# EAGLE design v2 (EAGLE 9.5.2)
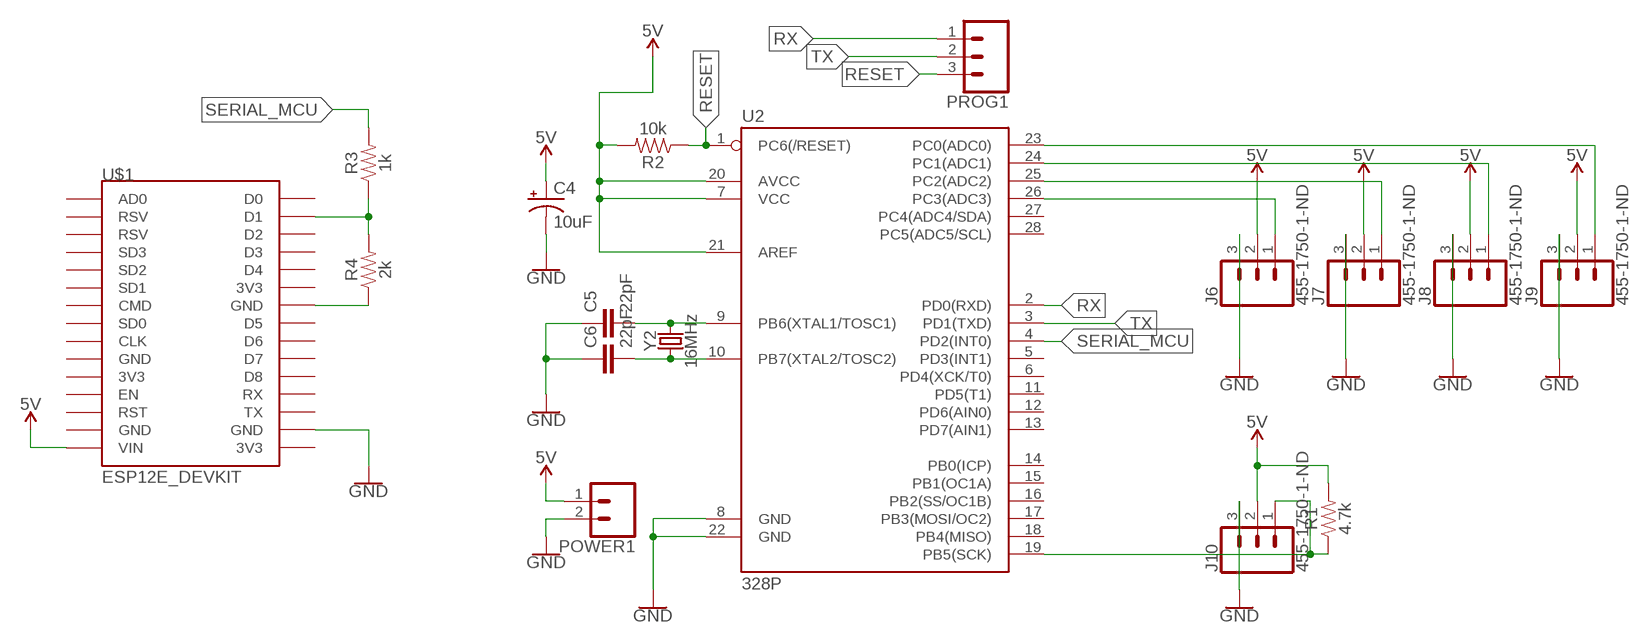
[diagram p0: schematic, sheet 1]

## Parts
C4  10uF  10UF-POLAR-RADIAL-2.5MM-25V-20%  [CPOL-RADIAL-2.5MM-5MM]
C5  22pF  22PF-PTH-2.54MM-200V-5%  [CAP-PTH-2.54]
C6  22pF  22PF-PTH-2.54MM-200V-5%  [CAP-PTH-2.54]
J6  455-1750-1-ND  CONN_03  [1X03]
J7  455-1750-1-ND  CONN_03  [1X03]
J8  455-1750-1-ND  CONN_03  [1X03]
J9  455-1750-1-ND  CONN_03  [1X03]
J10  455-1750-1-ND  CONN_03  [1X03]
POWER1  CONN_02  [1X02]
PROG1  CONN_03  [1X03]
R1  4.7k  10KOHM-HORIZ-1/4W-1%  [AXIAL-0.3]
R2  10k  1KOHM-HORIZ-1/4W-1%  [AXIAL-0.3]
R3  1k  10KOHM-HORIZ-1/4W-1%  [AXIAL-0.3]
R4  2k  10KOHM-HORIZ-1/4W-1%  [AXIAL-0.3]
U2  328P  ATMEGA328P_PDIP  [DIP28]
U$1  ESP12E_DEVKIT  [ESP12E_DEVKIT]
Y2  16MHz  CRYSTAL-16MHZPTH-HC49US  [HC49US]

## Nets
5V: C4.1(+) J6.2 J7.2 J8.2 J9.2 J10.2 POWER1.1 R1.P$2 R2.P$2 U2.7(VCC) U2.20(AVCC) U2.21(AREF) U$1.VIN
GND: C4.2(-) C5.1 C6.1 J6.3 J7.3 J8.3 J9.3 J10.3 POWER1.2 U2.8(GND) U2.22(GND) U$1.GND@3(GND)
N$1: C5.2 U2.9(PB6(XTAL1/TOSC1)) Y2.2
N$2: C6.2 U2.10(PB7(XTAL2/TOSC2)) Y2.1
N$3: J6.1 U2.26(PC3(ADC3))
N$4: J7.1 U2.25(PC2(ADC2))
N$5: J8.1 U2.24(PC1(ADC1))
N$6: J9.1 U2.23(PC0(ADC0))
N$7: R3.P$1 R4.P$2 U$1.D1
N$8: J10.1 R1.P$1 U2.19(PB5(SCK))
N$11: R4.P$1 U$1.GND@2(GND)
RESET: PROG1.3 R2.P$1 U2.1(PC6(/RESET))
RX: PROG1.1 U2.2(PD0(RXD))
SERIAL_MCU: R3.P$2 U2.4(PD2(INT0))
TX: PROG1.2 U2.3(PD1(TXD))
Unconnected: U2.5(PD3(INT1)) U2.6(PD4(XCK/T0)) U2.11(PD5(T1)) U2.12(PD6(AIN0)) U2.13(PD7(AIN1)) U2.14(PB0(ICP)) U2.15(PB1(OC1A)) U2.16(PB2(SS/OC1B)) U2.17(PB3(MOSI/OC2)) U2.18(PB4(MISO)) U2.27(PC4(ADC4/SDA)) U2.28(PC5(ADC5/SCL)) U$1.3V3@0(3V3) U$1.3V3@1(3V3) U$1.3V3@2(3V3) U$1.AD0 U$1.CLK U$1.CMD U$1.D0 U$1.D2 U$1.D3 U$1.D4 U$1.D5 U$1.D6 U$1.D7 U$1.D8 U$1.EN U$1.GND@0(GND) U$1.GND@1(GND) U$1.RST U$1.RSV@0(RSV) U$1.RSV@1(RSV) U$1.RX U$1.SD0 U$1.SD1 U$1.SD2 U$1.SD3 U$1.TX

## Library data of the parts
C4 = SparkFun-Capacitors:10UF-POLAR: 10.0µF polarized capacitors A capacitor is a passive two-terminal electrical component used to store electrical energy temporarily in an electric field.; PROD_ID: CAP-08440
C5 C6 = SparkFun-Capacitors:22PF: 22pF ceramic capacitors A capacitor is a passive two-terminal electrical component used to store electrical energy temporarily in an electric field.; PROD_ID: CAP-09128
J6-J10 = SparkFun-Connectors:CONN_03: Multi connection point. Often used as Generic Header-pin footprint for 0.1 inch spaced/style header connections On any of the 0.1 inch spaced packages, you can populate with these: Break Away Headers - Straight <https://www.sparkfun.com/products/116> (PRT-00116) Break Away Male Headers - Right Angle <https://www.sparkfun.com/products/553> (PRT-00553) Female Headers <https://www.sparkfun.com/products/115> (PRT-00115) Break Away Headers - Machine Pin <https://www.sparkfun.com/products/117> (PRT-00117) Break Away Female Headers - Swiss Machine Pin <https://www.sparkfun.com/products/743> (PRT-00743) Stackable Header - 3 Pin (Female, 0.1") <https://www.sparkfun.com/products/13875> (PRT-13875) For SCREWTERMINALS and SPRING TERMINALS visit here: Screw Terimnals on SparkFun.com <https://www.sparkfun.com/search/results?term=Screw+Terminals> (5mm/3.5mm/2.54mm spacing) This device is also useful as a general connection point to wire up your design to another part of your project. Our various solder wires solder well into these plated through hole pads. Hook-Up Wire - Assortment (Stranded, 22 AWG) <https://www.sparkfun.com/products/11375> (PRT-11375) Hook-Up Wire - Assortment (Solid Core, 22 AWG) <https://www.sparkfun.com/products/11367> (PRT-11367) View the entire wire category on our website here <https://www.sparkfun.com/categories/141> Special notes: Molex polarized connector foot print use with SKU : PRT-08232 with associated crimp pins and housings.; PROD_ID: XXX-00000
POWER1 = SparkFun-Connectors:CONN_02: Multi connection point. Often used as Generic Header-pin footprint for 0.1 inch spaced/style header connections On any of the 0.1 inch spaced packages, you can populate with these: Break Away Headers - Straight <https://www.sparkfun.com/products/116> (PRT-00116) Break Away Male Headers - Right Angle <https://www.sparkfun.com/products/553> (PRT-00553) Female Headers <https://www.sparkfun.com/products/115> (PRT-00115) Break Away Headers - Machine Pin <https://www.sparkfun.com/products/117> (PRT-00117) Break Away Female Headers - Swiss Machine Pin <https://www.sparkfun.com/products/743> (PRT-00743) For SCREWTERMINALS and SPRING TERMINALS visit here: Screw Terimnals on SparkFun.com <https://www.sparkfun.com/search/results?term=Screw+Terminals> (5mm/3.5mm/2.54mm spacing) This device is also useful as a general connection point to wire up your design to another part of your project. Our various solder wires solder well into these plated through hole pads. Hook-Up Wire - Assortment (Stranded, 22 AWG) <https://www.sparkfun.com/products/11375> (PRT-11375) Hook-Up Wire - Assortment (Solid Core, 22 AWG) <https://www.sparkfun.com/products/11367> (PRT-11367) View the entire wire category on our website here <https://www.sparkfun.com/categories/141> Special notes: Molex polarized connector foot print use with: PRT-08233 with associated crimp pins and housings. 2.54_SCREWTERM for use with PRT-10571. 3.5mm Screw Terminal footprints for PRT-08084 5mm Screw Terminal footprints for use with PRT-08432
PROG1 = SparkFun-Connectors:CONN_03: Multi connection point. Often used as Generic Header-pin footprint for 0.1 inch spaced/style header connections On any of the 0.1 inch spaced packages, you can populate with these: Break Away Headers - Straight <https://www.sparkfun.com/products/116> (PRT-00116) Break Away Male Headers - Right Angle <https://www.sparkfun.com/products/553> (PRT-00553) Female Headers <https://www.sparkfun.com/products/115> (PRT-00115) Break Away Headers - Machine Pin <https://www.sparkfun.com/products/117> (PRT-00117) Break Away Female Headers - Swiss Machine Pin <https://www.sparkfun.com/products/743> (PRT-00743) Stackable Header - 3 Pin (Female, 0.1") <https://www.sparkfun.com/products/13875> (PRT-13875) For SCREWTERMINALS and SPRING TERMINALS visit here: Screw Terimnals on SparkFun.com <https://www.sparkfun.com/search/results?term=Screw+Terminals> (5mm/3.5mm/2.54mm spacing) This device is also useful as a general connection point to wire up your design to another part of your project. Our various solder wires solder well into these plated through hole pads. Hook-Up Wire - Assortment (Stranded, 22 AWG) <https://www.sparkfun.com/products/11375> (PRT-11375) Hook-Up Wire - Assortment (Solid Core, 22 AWG) <https://www.sparkfun.com/products/11367> (PRT-11367) View the entire wire category on our website here <https://www.sparkfun.com/categories/141> Special notes: Molex polarized connector foot print use with SKU : PRT-08232 with associated crimp pins and housings.
R1 R3 R4 = SparkFun-Resistors:10KOHM: 10kΩ resistor A resistor is a passive two-terminal electrical component that implements electrical resistance as a circuit element. Resistors act to reduce current flow, and, at the same time, act to lower voltage levels within circuits. - Wikipedia; PROD_ID: RES-12183; VALUE: 10k
R2 = SparkFun-Resistors:1KOHM: 1kΩ resistor A resistor is a passive two-terminal electrical component that implements electrical resistance as a circuit element. Resistors act to reduce current flow, and, at the same time, act to lower voltage levels within circuits. - Wikipedia; PROD_ID: RES-12182; VALUE: 1k
U2 = SparkFun-IC-Microcontroller:ATMEGA328P_PDIP: Atmel 328P Through hole ATMEGA328P uC used in the Arduino 32kb flash, 1k EEPROM, 2k SRAM Datasheet <http://www.sparkfun.com/datasheets/Components/SMD/ATMega328.pdf> SparkFun Products Storefront component: AVR 28 Pin 20MHz 32K 6A/D - ATMega328P <https://www.sparkfun.com/products/9061> (COM-09061) SparkFun Simon Says - Through-Hole Soldering Kit <https://www.sparkfun.com/products/10547> (KIT-10547) SparkFun Learn to Solder - Simon Says <https://www.sparkfun.com/products/13708> (KIT-13708) SparkFun BigTime Watch Kit <https://www.sparkfun.com/products/11734> (KIT-11734) SparkFun ClockIt <https://www.sparkfun.com/products/10930> (KIT-10930) SparkFun Serial Enabled LCD Kit <https://www.sparkfun.com/products/10097> (LCD-10097) SparkFun Simon Tilts - Through Hole Soldering Kit <https://www.sparkfun.com/products/12634> (KIT-12634) SparkFun Frequency Counter Kit <https://www.sparkfun.com/products/10140> (KIT-10140) FabFM Radio Kit <https://www.sparkfun.com/products/11043> (KIT-11043) SparkFun Binary Blaster Kit <https://www.sparkfun.com/products/12037> (KIT-12037) SparkFun Metro-Gnome <https://www.sparkfun.com/products/9236> (KIT-09236) ATmega328 with Arduino Optiboot (Uno) <https://www.sparkfun.com/products/10524> (DEV-10524); PROD_ID: IC-09136
U$1 = ESP12E_DEVKIT:ESP12E_DEVKIT: ESP12E DEVKIT BOARD
Y2 = SparkFun-Clocks:CRYSTAL-16MHZ: 16MHz Crystal Digikey Example <http://www.digikey.com/product-search/en?keywords=535-9122-1-ND> Frequency: 16MHz Frequency Stability: ±50ppm Frequency Tolerance: ±20ppm Load Capacitance: 18pF SparkFun Products: Pro Micro -5V/16MHz <https://www.sparkfun.com/products/12640> SparkFun Serial Enabled LCD Kit <https://www.sparkfun.com/products/10097>; PROD_ID: XTAL-08181; SF_ID: COM-00536

## Board
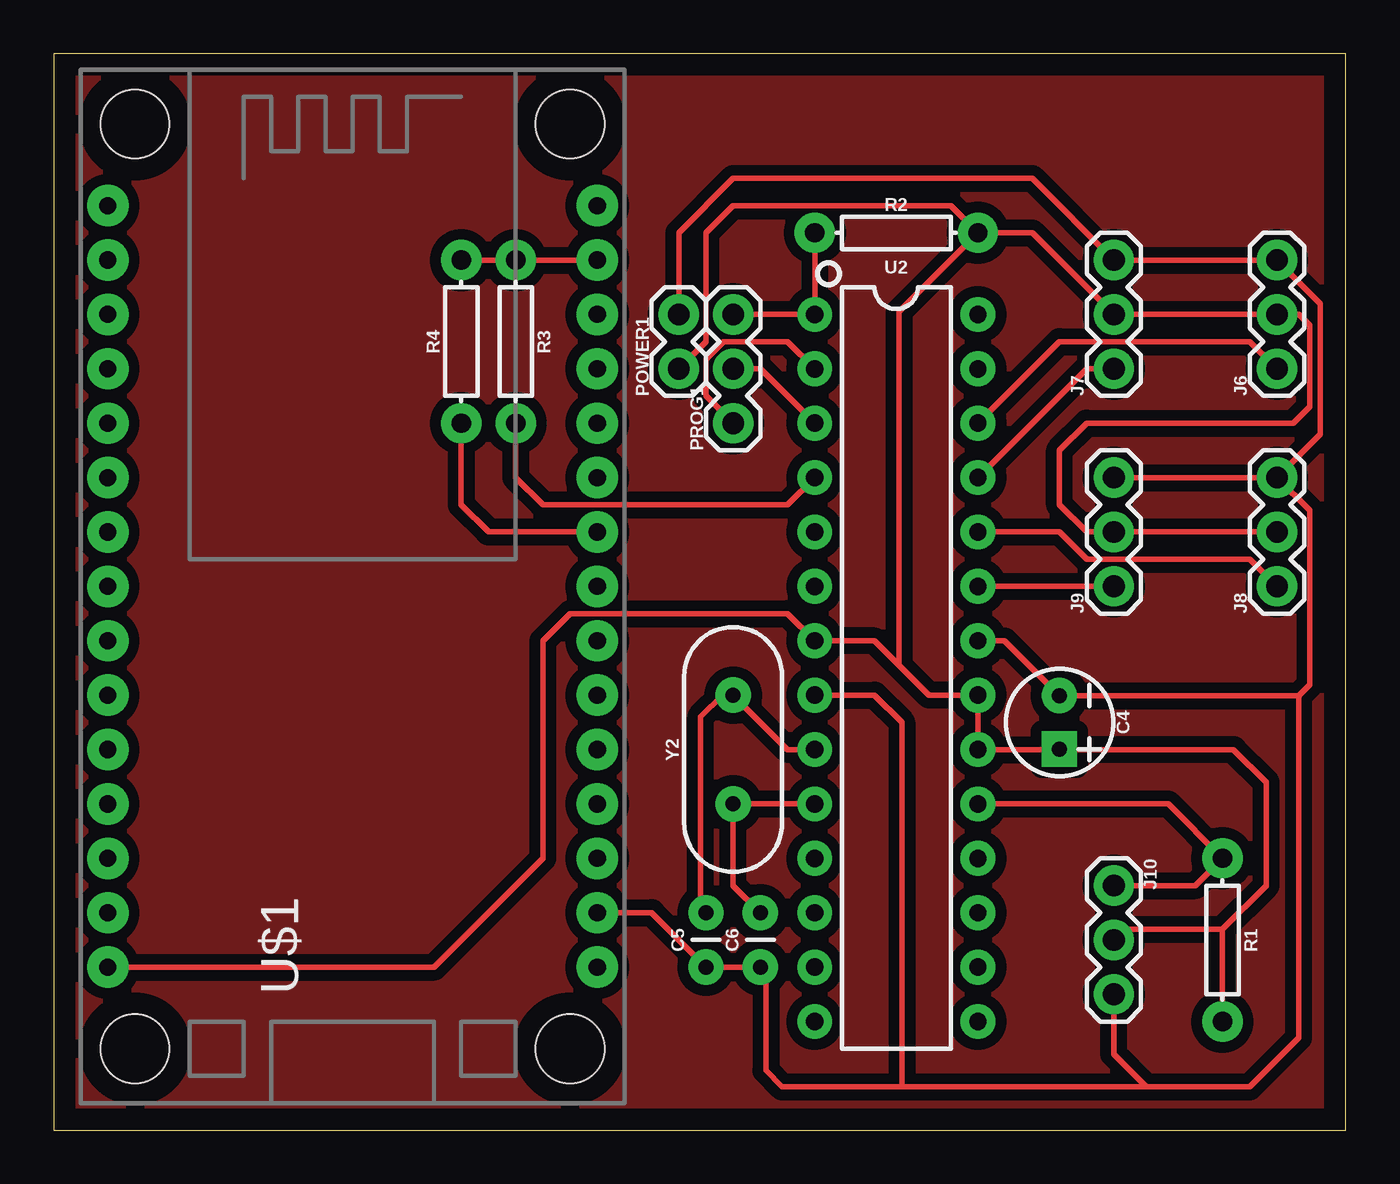
[diagram p1: board, top side]

Size 60.38 x 50.28 mm. Coordinates in mm from the lower left corner, seen from the top.
Outline: 0,0 60.38,0 60.38,50.28 0,50.28 0,0
Copper layers (1*16): Top 0.035mm / dielectric 1.5mm / Bottom 0.035mm
Design rules "default": minimum track width 6mil, minimum drill 0.35mm, track to track 6mil, track to pad 6mil, pad to pad 6mil, via to via 6mil, smd to smd 6mil, copper to edge 40mil, drill to drill 6mil, minimum pad ring 10mil, minimum via ring 8mil, stop-mask expansion 4mil, vias tented up to drill 0mil, thermal gap 10mil

### Footprints (pad centres in the part's own frame; a part is rotated, then mirrored left to right if it is on the bottom)
CPOL-RADIAL-2.5MM-5MM = drill 0.7 pad 1.651 square: 1 1.25,0 | drill 0.7 pad 1.651: 2 -1.25,0
CAP-PTH-2.54 = drill 0.7 pad 1.651: 1 -1.27,0; 2 1.27,0
1X03 = drill 1.016 pad 1.88: 1 0,0; 2 2.54,0; 3 5.08,0
1X02 = drill 1.016 pad 1.88: 1 0,0; 2 2.54,0
AXIAL-0.3 = drill 0.9 pad 1.88: P$1 -3.81,0; P$2 3.81,0
DIP28 = drill 0.813 pad 1.626: 1 -16.51,-3.81; 2 -13.97,-3.81; 3 -11.43,-3.81; 4 -8.89,-3.81; 5 -6.35,-3.81; 6 -3.81,-3.81; 7 -1.27,-3.81; 8 1.27,-3.81; 9 3.81,-3.81; 10 6.35,-3.81; 11 8.89,-3.81; 12 11.43,-3.81; 13 13.97,-3.81; 14 16.51,-3.81; 15 16.51,3.81; 16 13.97,3.81; 17 11.43,3.81; 18 8.89,3.81; 19 6.35,3.81; 20 3.81,3.81; 21 1.27,3.81; 22 -1.27,3.81; 23 -3.81,3.81; 24 -6.35,3.81; 25 -8.89,3.81; 26 -11.43,3.81; 27 -13.97,3.81; 28 -16.51,3.81
ESP12E_DEVKIT = drill 0.8 pad 1.93: 3V3@0 -11.43,-7.62; 3V3@1 11.43,5.08; 3V3@2 11.43,-17.78; AD0 -11.43,17.78; CLK -11.43,-2.54; CMD -11.43,2.54; D0 11.43,17.78; D1 11.43,15.24; D2 11.43,12.7; D3 11.43,10.16; D4 11.43,7.62; D5 11.43,0; D6 11.43,-2.54; D7 11.43,-5.08; D8 11.43,-7.62; EN -11.43,-10.16; GND@0 -11.43,-5.08; GND@1 -11.43,-15.24; GND@2 11.43,2.54; GND@3 11.43,-15.24; RST -11.43,-12.7; RSV@0 -11.43,15.24; RSV@1 -11.43,12.7; RX 11.43,-10.16; SD0 -11.43,0; SD1 -11.43,5.08; SD2 -11.43,7.62; SD3 -11.43,10.16; TX 11.43,-12.7; VIN -11.43,-17.78 | hole 3.2: -10.16,21.59; 10.16,21.59; 10.16,-21.59; -10.16,-21.59
HC49US = drill 0.7 pad 1.651: 1 -2.54,0; 2 2.54,0

### Placement (x,y rotation side)
C4  46.99,19.05 270 top
C5  30.48,8.89 90 top
C6  33.02,8.89 90 top
J6  57.15,35.56 90 top
J7  49.53,35.56 90 top
J8  57.15,25.4 90 top
J9  49.53,25.4 90 top
J10  49.53,11.43 270 top
POWER1  29.21,35.56 90 top
PROG1  31.75,33.02 90 top
R1  54.61,8.89 270 top
R2  39.37,41.91 0 top
R3  21.59,36.83 270 top
R4  19.05,36.83 90 top
U2  39.37,21.59 270 top
U$1  13.97,25.4 0 top
Y2  31.75,17.78 90 top

### Tracks (layer width: path | path; a pad name or v marks a point on that pad's centre or on a via)
5V
  Top 0.254: POWER1.1 30.48,36.83 30.48,41.91 31.75,43.18 41.91,43.18 R2.P$2 | 46.97,17.78 U2.20 U2.21 40.89,20.32 39.5,21.72 | 46.97,17.78 C4.1 | 39.5,21.72 38.35,22.86 U2.7 34.29,24.13 24.13,24.13 22.86,22.86 22.86,12.7 17.78,7.62 U$1.VIN | R2.P$2 39.5,38.23 39.5,21.72 | 54.61,9.4 56.64,11.43 56.64,16.26 55.12,17.78 46.97,17.78 | J10.2 50.04,9.4 54.61,9.4 | R1.P$2 54.61,9.4 | R2.P$2 45.72,41.91 J7.2 J6.2 58.17,38.1 58.67,37.59 58.67,33.78 57.91,33.02 48.26,33.02 46.99,31.75 46.99,29.21 48.26,27.94 J9.2 J8.2
GND
  Top 0.254: U2.22 44.43,22.86 C4.2 58.17,20.3 | 51.05,2.03 49.53,3.56 J10.3 | 51.05,2.03 55.88,2.03 58.17,4.32 58.17,20.3 | 39.62,2.03 34.04,2.03 33.27,2.79 33.27,7.37 C6.1 C5.1 27.94,10.16 U$1.GND@3 | 39.62,2.03 51.05,2.03 | U2.8 38.35,20.32 39.62,19.05 39.62,2.03 | POWER1.2 29.21,41.91 31.75,44.45 45.72,44.45 J7.3 J6.3 59.18,38.61 59.18,32.51 J8.3 | J9.3 J8.3 | J8.3 58.67,28.96 58.67,20.81 58.17,20.3
N$1
  Top 0.254: U2.9 34.29,17.78 Y2.2 31.24,20.32 30.23,19.3 30.23,10.41 C5.2
N$2
  Top 0.254: U2.10 Y2.1 31.75,11.43 C6.2
N$3
  Top 0.254: U2.26 46.99,36.83 55.88,36.83 J6.1
N$4
  Top 0.254: U2.25 48.26,35.56 J7.1
N$5
  Top 0.254: U2.24 46.99,27.94 48.26,26.67 55.88,26.67 J8.1
N$6
  Top 0.254: U2.23 J9.1
N$7
  Top 0.254: R4.P$2 R3.P$1 U$1.D1
N$8
  Top 0.254: U2.19 52.07,15.24 R1.P$1 53.34,11.43 J10.1
N$11
  Top 0.254: R4.P$1 19.05,29.21 20.32,27.94 U$1.GND@2
NEW
  pour Top (isolate 0.508): 0,50.29 60.45,50.29 60.45,0.25 60.71,0 0,0
RESET
  Top 0.254: PROG1.3 U2.1 R2.P$1
RX
  Top 0.254: PROG1.1 30.48,34.29 30.48,36.01 31.3,36.83 34.29,36.83 U2.2
SERIAL_MCU
  Top 0.254: R3.P$2 21.59,30.48 22.86,29.21 34.29,29.21 U2.4
TX
  Top 0.254: PROG1.2 33.02,35.56 U2.3